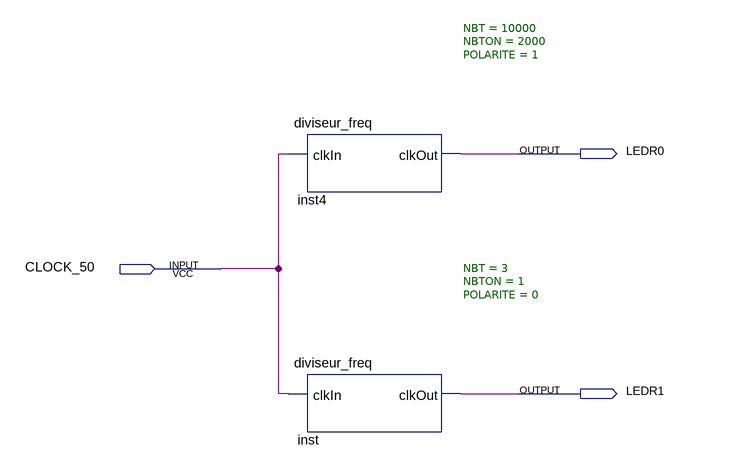
[diagram p0: schematic sheet]
// Quartus schematic led_blink.bdf as structural Verilog: 2 symbols, 3 pins
module led_blink (
  input  CLOCK_50,
  output LEDR0,
  output LEDR1
);

  diviseur_freq #(.NBT(10000), .NBTON(2000), .POLARITE(1)) inst4 (.clkIn(CLOCK_50), .clkOut(LEDR0));
  diviseur_freq #(.NBT(3), .NBTON(1), .POLARITE(0)) inst (.clkIn(CLOCK_50), .clkOut(LEDR1));
endmodule
